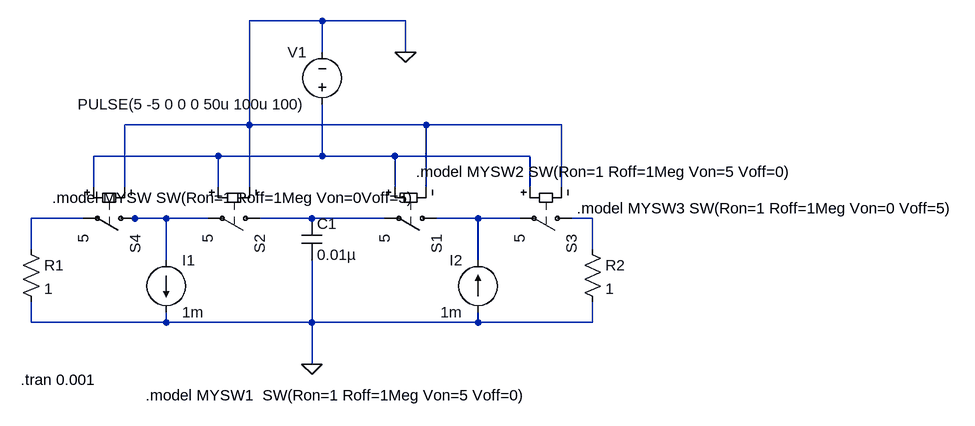
[diagram p0: schematic VCSAshlesh.asc]
VCSAshlesh.asc, the LTspice schematic file:
Version 4
SHEET 1 1208 680
WIRE 192 -64 80 -64
WIRE 320 -64 192 -64
WIRE 192 -16 192 -64
WIRE 320 -16 320 -64
WIRE 80 96 80 -64
WIRE 80 96 -112 96
WIRE 352 96 80 96
WIRE 560 96 352 96
WIRE 32 144 -160 144
WIRE 192 144 192 64
WIRE 192 144 32 144
WIRE 304 144 192 144
WIRE 512 144 304 144
WIRE -160 192 -160 144
WIRE -112 192 -112 96
WIRE 32 192 32 144
WIRE 80 192 80 96
WIRE 304 192 304 144
WIRE 352 192 352 96
WIRE 512 192 512 144
WIRE 560 192 560 96
WIRE -176 240 -256 240
WIRE -96 240 -112 240
WIRE -48 240 -96 240
WIRE 16 240 -48 240
WIRE 176 240 96 240
WIRE 288 240 176 240
WIRE 432 240 368 240
WIRE 496 240 432 240
WIRE 608 240 576 240
WIRE -256 288 -256 240
WIRE 608 288 608 240
WIRE -48 304 -48 240
WIRE 432 304 432 240
WIRE -256 400 -256 368
WIRE -48 400 -48 384
WIRE -48 400 -256 400
WIRE 176 400 176 304
WIRE 176 400 -48 400
WIRE 432 400 432 384
WIRE 432 400 176 400
WIRE 608 400 608 368
WIRE 608 400 432 400
WIRE 176 464 176 400
FLAG 176 464 0
FLAG 320 -16 0
SYMBOL voltage 192 80 R180
WINDOW 0 24 96 Left 2
WINDOW 3 24 16 Left 2
WINDOW 123 0 0 Left 0
WINDOW 39 0 0 Left 0
SYMATTR InstName V1
SYMATTR Value PULSE(5 -5 0 0 0 50u 100u 100)
SYMBOL cap 160 240 R0
SYMATTR InstName C1
SYMATTR Value 0.01µ
SYMBOL sw 384 240 R90
SYMATTR InstName S1
SYMATTR Value 5
SYMATTR SpiceModel MYSW2
SYMBOL sw 112 240 R90
SYMATTR InstName S2
SYMATTR Value 5
SYMATTR SpiceModel MYSW1
SYMBOL sw 592 240 R90
SYMATTR InstName S3
SYMATTR Value 5
SYMATTR SpiceModel MYSW3
SYMBOL sw -80 240 R90
SYMATTR InstName S4
SYMATTR Value 5
SYMATTR SpiceModel MYSW
SYMBOL current -48 304 R0
WINDOW 123 0 0 Left 0
WINDOW 39 0 0 Left 0
SYMATTR InstName I1
SYMATTR Value 1m
SYMBOL current 432 384 R180
WINDOW 0 24 80 Left 2
WINDOW 3 24 0 Left 2
WINDOW 123 0 0 Left 0
WINDOW 39 0 0 Left 0
SYMATTR InstName I2
SYMATTR Value 1m
SYMBOL res -272 272 R0
SYMATTR InstName R1
SYMATTR Value 1
SYMBOL res 592 272 R0
SYMATTR InstName R2
SYMATTR Value 1
TEXT -272 488 Left 2 !.tran 0.001
TEXT -224 208 Left 2 !.model MYSW SW(Ron=1 Roff=1Meg Von=0Voff=5)
TEXT -80 512 Left 2 !.model MYSW1  SW(Ron=1 Roff=1Meg Von=5 Voff=0)
TEXT 336 168 Left 2 !.model MYSW2 SW(Ron=1 Roff=1Meg Von=5 Voff=0)
TEXT 584 224 Left 2 !.model MYSW3 SW(Ron=1 Roff=1Meg Von=0 Voff=5)

The netlist it stands for:
* VCSAshlesh.asc
V1 N001 0 PULSE(5 -5 0 0 0 50u 100u 100)
C1 N004 0 0.01µ
S1 N005 N004 N001 0 MYSW2 5
S2 N004 N003 N001 0 MYSW1 5
S3 N006 N005 N001 0 MYSW3 5
S4 N003 N002 N001 0 MYSW 5
I1 N003 0 1m
I2 0 N005 1m
R1 N002 0 1
R2 N006 0 1
.tran 0.001
.model MYSW SW(Ron=1 Roff=1Meg Von=0Voff=5)
.model MYSW1  SW(Ron=1 Roff=1Meg Von=5 Voff=0)
.model MYSW2 SW(Ron=1 Roff=1Meg Von=5 Voff=0)
.model MYSW3 SW(Ron=1 Roff=1Meg Von=0 Voff=5)
.backanno
.end